# EAGLE design RCR-433-MPR_Receiver (EAGLE 5.06)
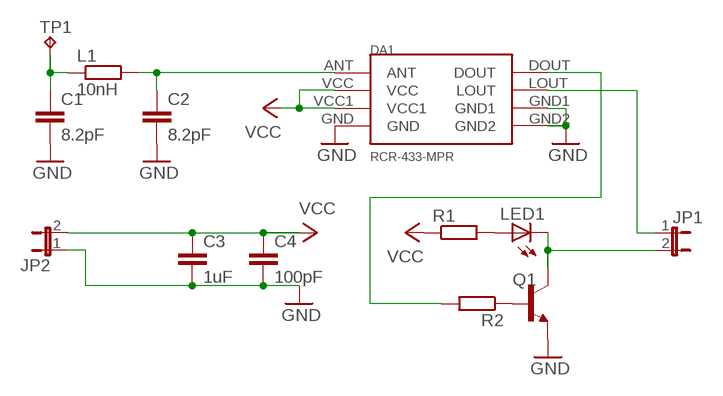
[diagram p0: schematic, sheet 1]

## Parts
C1  8.2pF  C-EUC0805  [C0805]
C2  8.2pF  C-EUC0805  [C0805]
C3  1uF  C-EUC0805  [C0805]
C4  100pF  C-EUC0805  [C0805]
DA1  RCR-433-MPR  [RCR-433-MPR]
JP1  JP1E  [JP1]
JP2  JP1E  [JP1]
L1  10nH  R-EU_R0805  [R0805]
LED1  LEDCHIP-LED0805  [CHIP-LED0805]
Q1  BC817-16LT1SMD  [SOT23-BEC]
R1  R-EU_R0805  [R0805]
R2  R-EU_R0805  [R0805]
TP1  TPB2,54  [B2,54]

## Nets
ANT: C2.1 DA1.ANT L1.2
DOUT: DA1.DOUT R2.2
GND: C1.2 C2.2 C3.2 C4.2 DA1.GND DA1.GND1 DA1.GND2 JP2.1 Q1.E
LOUT: DA1.LOUT JP1.1
N$1: C1.1 L1.1 TP1.PP(TP)
N$2: Q1.B R2.1
N$3: LED1.A R1.2
N$4: JP1.2 LED1.C Q1.C
VCC: C3.1 C4.1 DA1.VCC DA1.VCC1 JP2.2 R1.1

## Library data of the parts
C1-C4 = rcl:C-EU: CAPACITOR, European symbol
DA1 = radiotronix:RCR-433-MPR: RCR-433-MPR Radiotronix 433 MHz receiver
JP1 JP2 = jumper:JP1E: JUMPER
L1 R1 R2 = rcl:R-EU_: RESISTOR, European symbol
LED1 = led:LED: LED OSRAM: - CHIPLED LG R971, LG N971, LY N971, LG Q971, LY Q971, LO R971, LY R971 LH N974, LH R974 LS Q976, LO Q976, LY Q976 LO Q996 - Hyper CHIPLED LW Q18S LB Q993, LB Q99A, LB R99A - SideLED LS A670, LO A670, LY A670, LG A670, LP A670 LB A673, LV A673, LT A673, LW A673 LH A674 LY A675 LS A676, LA A676, LO A676, LY A676, LW A676 LS A679, LY A679, LG A679 - Hyper Micro SIDELED® LS Y876, LA Y876, LO Y876, LY Y876 LT Y87S - SmartLED LW L88C, LW L88S LB L89C, LB L89S, LG L890 LS L89K, LO L89K, LY L89K LS L896, LA L896, LO L896, LY L896 - TOPLED LS T670, LO T670, LY T670, LG T670, LP T670 LSG T670, LSP T670, LSY T670, LOP T670, LYG T670 LG T671, LOG T671, LSG T671 LB T673, LV T673, LT T673, LW T673 LH T674 LS T676, LA T676, LO T676, LY T676, LB T676, LH T676, LSB T676, LW T676 LB T67C, LV T67C, LT T67C, LS T67K, LO T67K, LY T67K, LW E67C LS E67B, LA E67B, LO E67B, LY E67B, LB E67C, LV E67C, LT E67C LW T67C LS T679, LY T679, LG T679 LS T770, LO T770, LY T770, LG T770, LP T770 LB T773, LV T773, LT T773, LW T773 LH T774 LS E675, LA E675, LY E675, LS T675 LS T776, LA T776, LO T776, LY T776, LB T776 LHGB T686 LT T68C, LB T68C - Hyper Mini TOPLED® LB M676 - Mini TOPLED Santana® LG M470 LS M47K, LO M47K, LY M47K Source: http://www.osram.convergy.de LUXEON: - LUMILED® LXK2-PW12-R00, LXK2-PW12-S00, LXK2-PW14-U00, LXK2-PW14-V00 LXK2-PM12-R00, LXK2-PM12-S00, LXK2-PM14-U00 LXK2-PE12-Q00, LXK2-PE12-R00, LXK2-PE12-S00, LXK2-PE14-T00, LXK2-PE14-U00 LXK2-PB12-K00, LXK2-PB12-L00, LXK2-PB12-M00, LXK2-PB14-N00, LXK2-PB14-P00, LXK2-PB14-Q00 LXK2-PR12-L00, LXK2-PR12-M00, LXK2-PR14-Q00, LXK2-PR14-R00 LXK2-PD12-Q00, LXK2-PD12-R00, LXK2-PD12-S00 LXK2-PH12-R00, LXK2-PH12-S00 LXK2-PL12-P00, LXK2-PL12-Q00, LXK2-PL12-R00 Source: www.luxeon.com KINGBRIGHT: KA-3528ASYC Source: www.kingbright.com
Q1 = transistor-npn:BC817*: NPN Transistor
TP1 = testpad:TP: Test pad

## Board
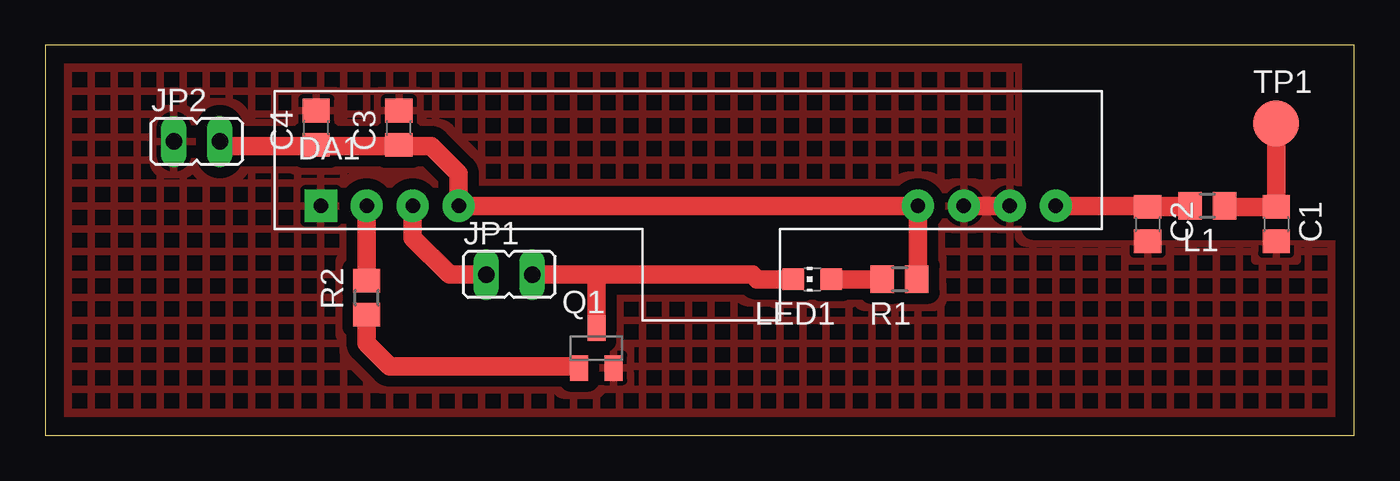
[diagram p1: board, top side]

Size 72.39 x 21.59 mm. Coordinates in mm from the lower left corner, seen from the top.
Outline: 0,0 72.39,0 72.39,21.59 0,21.58 0,0
Copper layers (1*16): Top 0.035mm / dielectric 1.5mm / Bottom 0.035mm
Design rules "default": minimum track width 10mil, minimum drill 24mil, track to track 8mil, track to pad 8mil, pad to pad 8mil, via to via 8mil, smd to smd 8mil, copper to edge 40mil, drill to drill 8mil, minimum pad ring 10mil, minimum via ring 8mil, stop-mask expansion 4mil, vias tented up to drill 0mil, thermal gap 10mil
tRestrict: area 54.6,11.4 to 72.4,21.6

### Footprints (pad centres in the part's own frame; a part is rotated, then mirrored left to right if it is on the bottom)
C0805 = smd 1.3 x 1.5: 1 -0.95,0; 2 0.95,0
RCR-433-MPR = drill 0.8 pad 1.778 round: ANT 40.64,0; DOUT 2.54,0; GND1 35.56,0; GND2 38.1,0; LOUT 5.08,0; VCC 7.62,0; VCC1 33.02,0 | drill 0.8 pad 1.778 square: GND 0,0
JP1 = drill 0.914 long: 1 0,-1.27; 2 0,1.27
R0805 = smd 1.3 x 1.5: 1 -0.95,0; 2 0.95,0
CHIP-LED0805 = smd 1.2 x 1.2: A 0,-1.05; C 0,1.05
SOT23-BEC = smd 1 x 1.4: B -0.95,-1.1; C 0,1.1; E 0.95,-1.1
B2,54 = smd 2.54 x 2.54: PP 0,0

### Placement (x,y rotation side)
C1  68.07,11.68 270 top
C2  60.96,11.68 270 top
C3  19.56,17.02 90 top
C4  14.99,17.02 90 top
DA1  15.24,12.7 0 top
JP1  25.65,8.89 270 top
JP2  8.38,16.26 270 top
L1  64.26,12.7 180 top
LED1  42.42,8.64 90 top
Q1  30.48,4.83 0 top
R1  47.24,8.64 180 top
R2  17.78,7.62 90 top
TP1  68.07,17.27 0 top

### Tracks (layer width: path | path; a pad name or v marks a point on that pad's centre or on a via)
ANT
  Top 1.016: DA1.ANT L1.2 63.25,12.63 C2.1
DOUT
  Top 1.016: R2.2 DA1.DOUT
GND
  Top 1.016: DA1.GND1 DA1.GND2
  pour Top (isolate 0.61, hatched): 0,21.59 72.39,21.59 72.39,0 0,0
LOUT
  Top 1.016: DA1.LOUT 20.32,10.92 22.35,8.89 JP1.1
N$1
  Top 1.016: L1.1 65.28,12.63 C1.1 TP1.PP
N$2
  Top 1.016: R2.1 17.78,5.08 19.05,3.81 29.45,3.81 Q1.B
N$3
  Top 1.016: LED1.A R1.2
N$4
  Top 1.016: JP1.2 30.48,8.89 | 30.48,8.89 39.12,8.89 39.37,8.64 LED1.C | 30.48,8.89 Q1.C
VCC
  Top 1.016: 15.05,16 9.91,16 JP2.2 | 15.05,16 19.62,16 | 15.05,16 C4.1 | 19.62,16 21.34,16 22.86,14.48 DA1.VCC DA1.VCC1 48.26,8.7 R1.1 | 19.62,16 C3.1